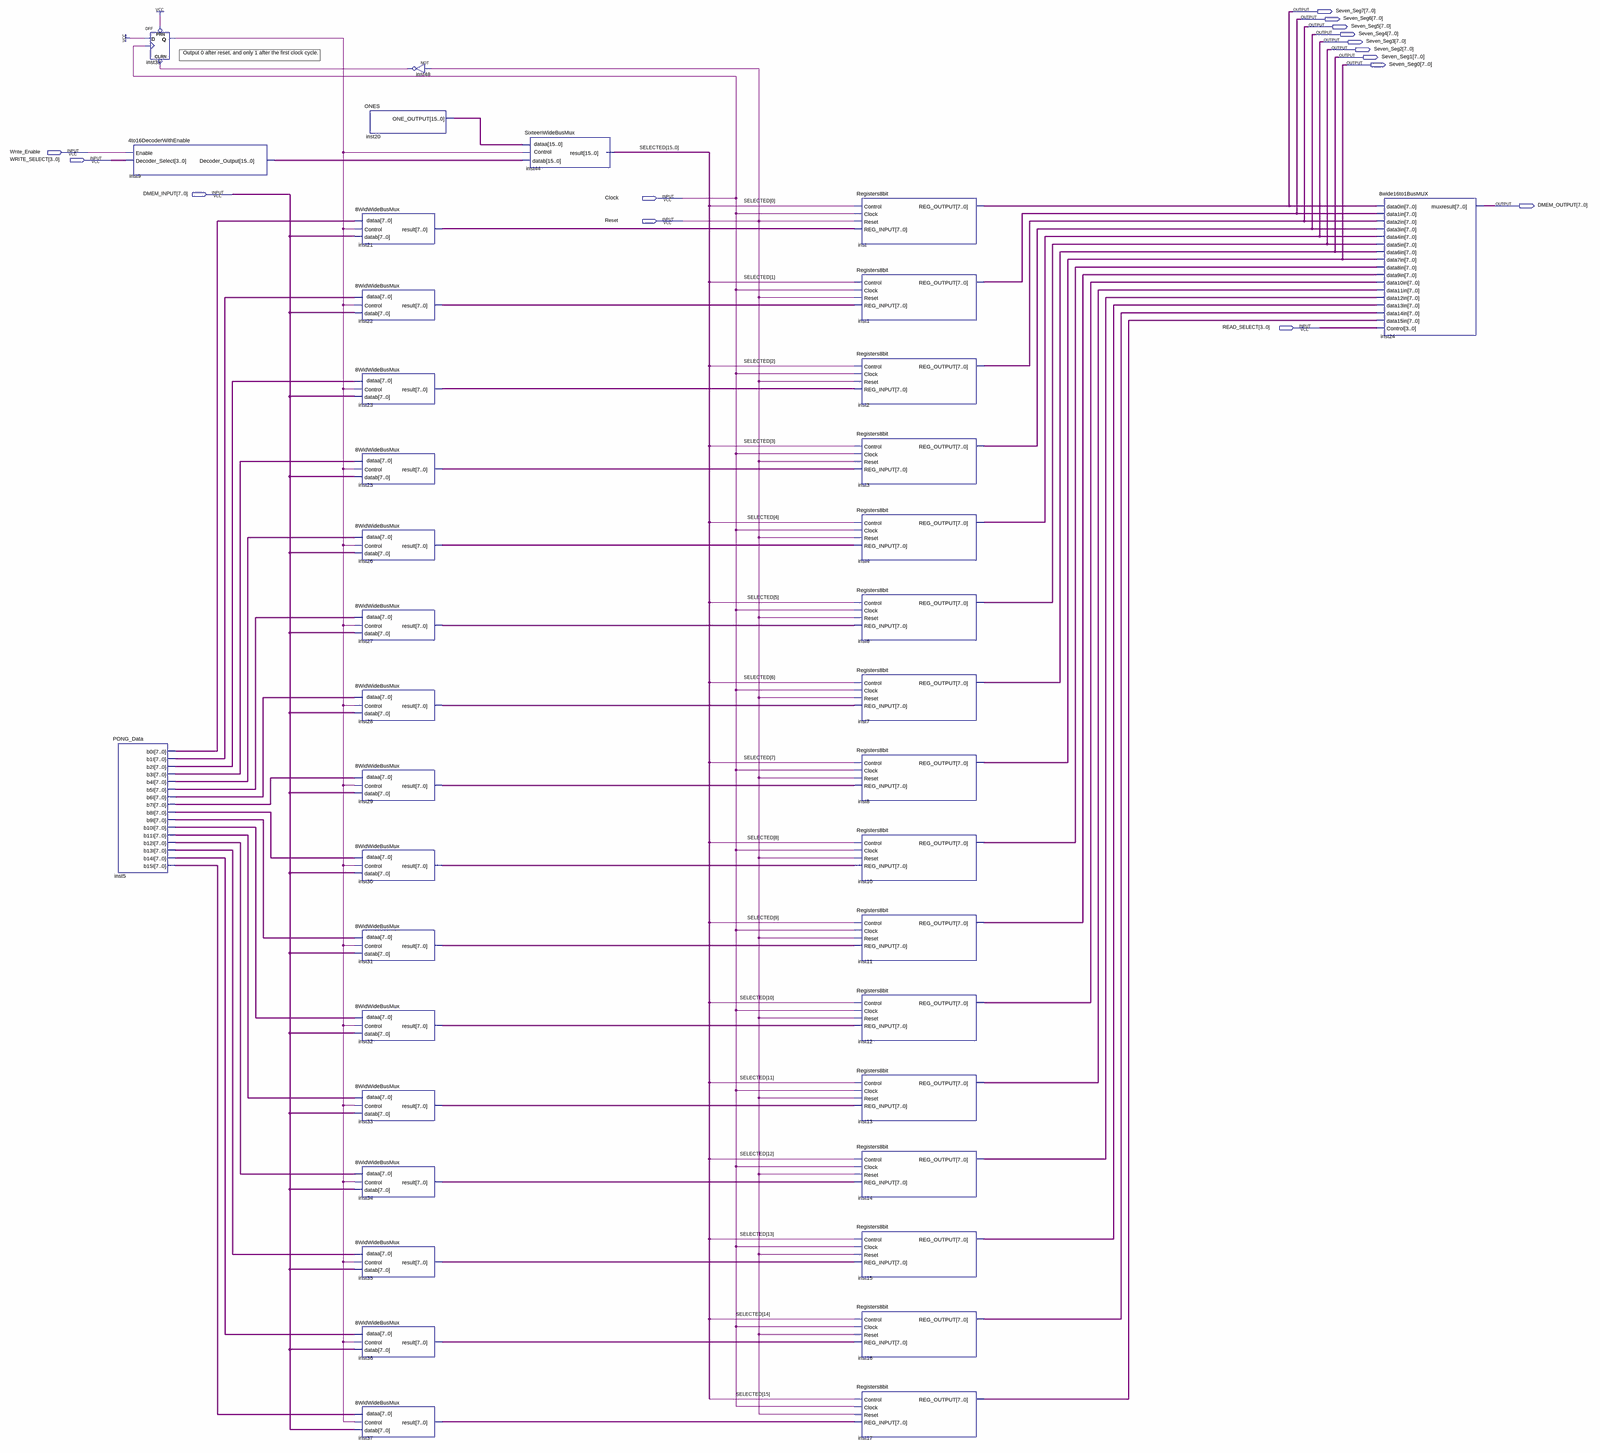
[diagram p0: schematic sheet, whole]
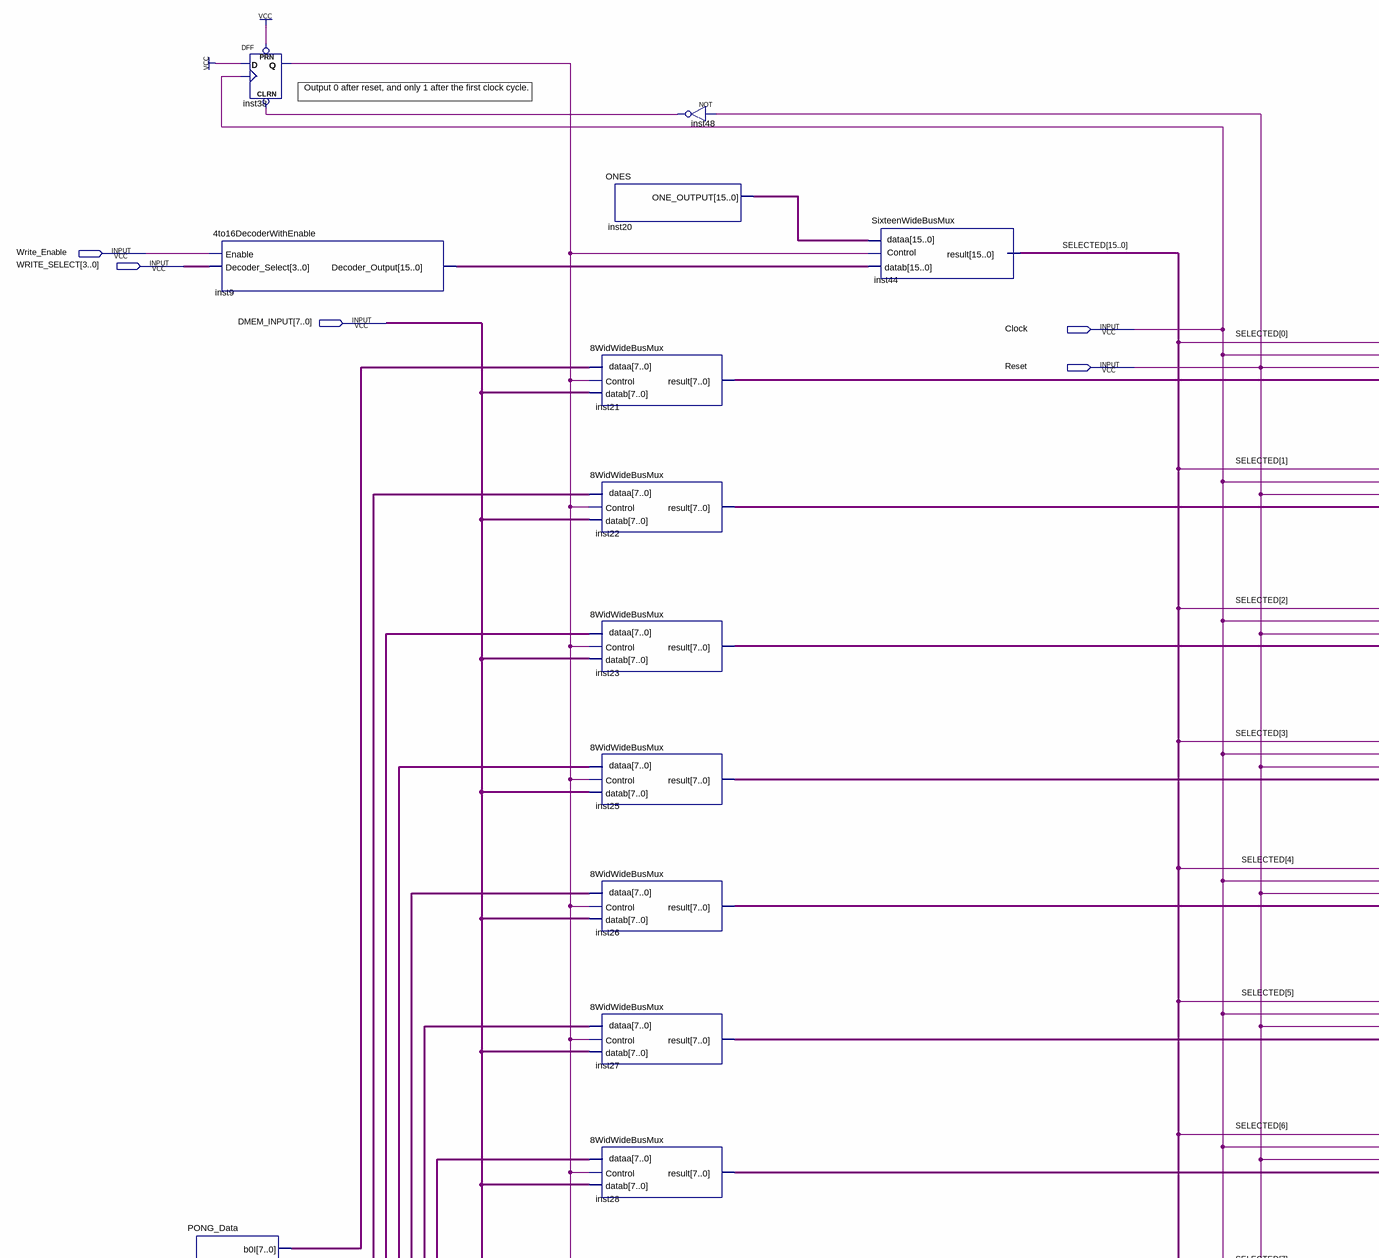
[diagram p1: schematic sheet, upper left part]
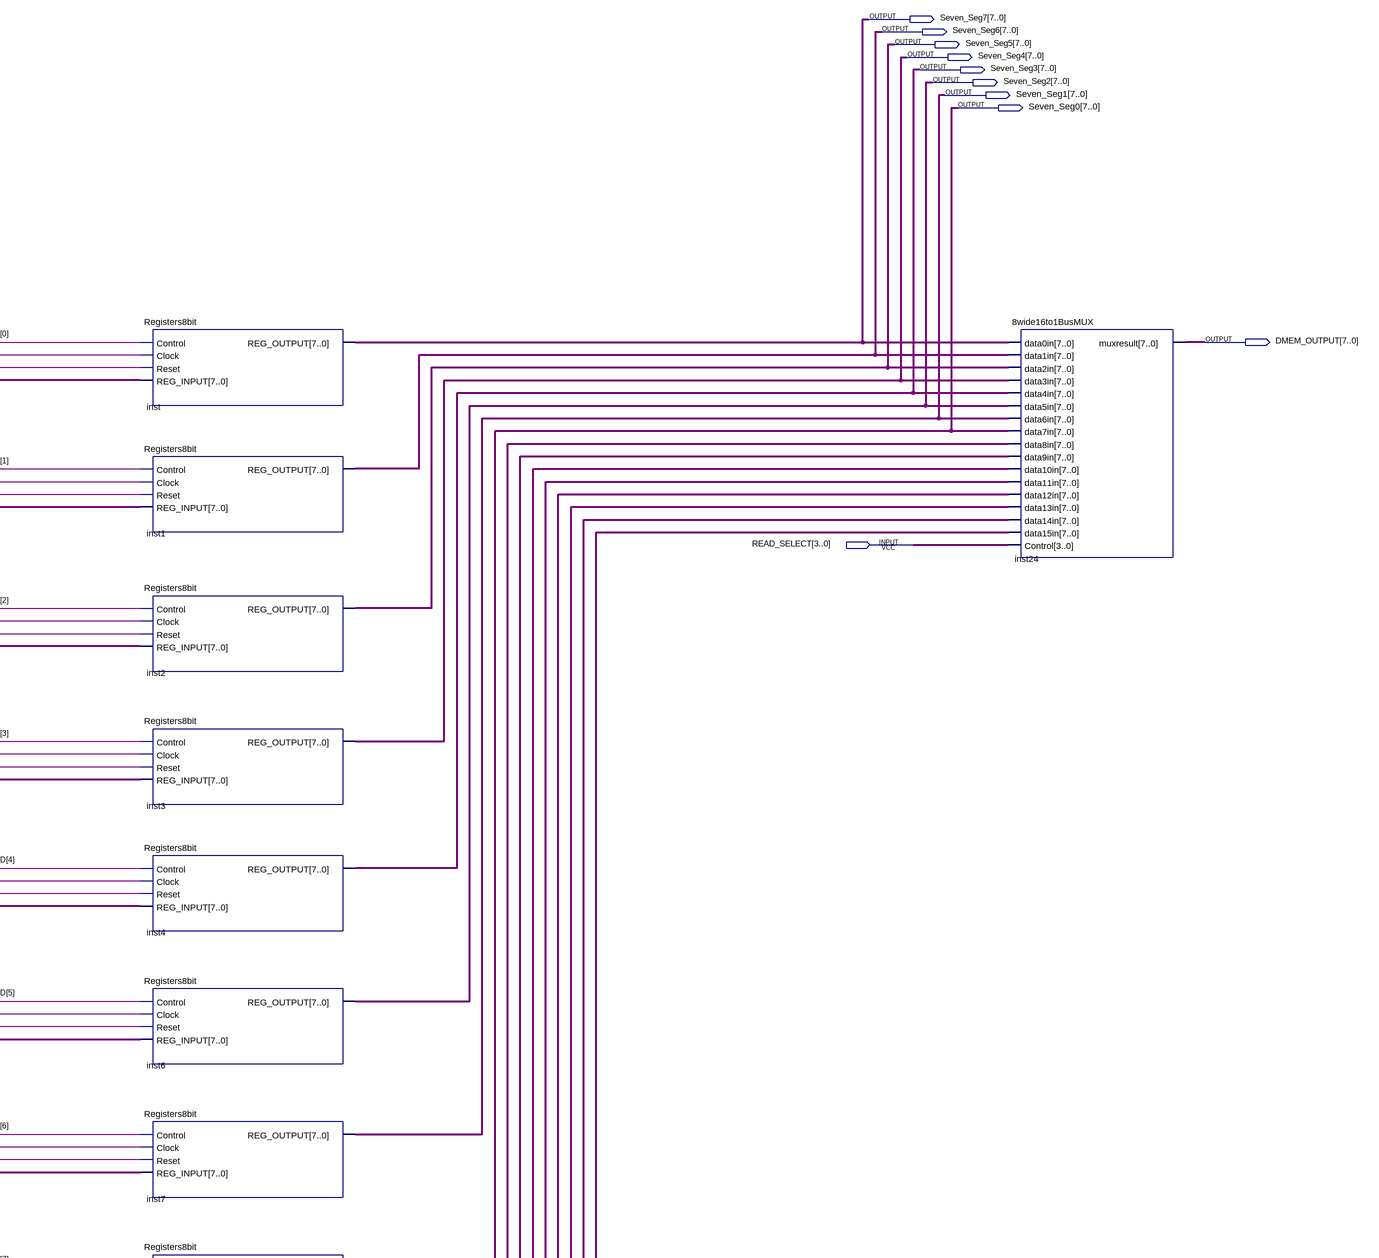
[diagram p2: schematic sheet, upper right part]
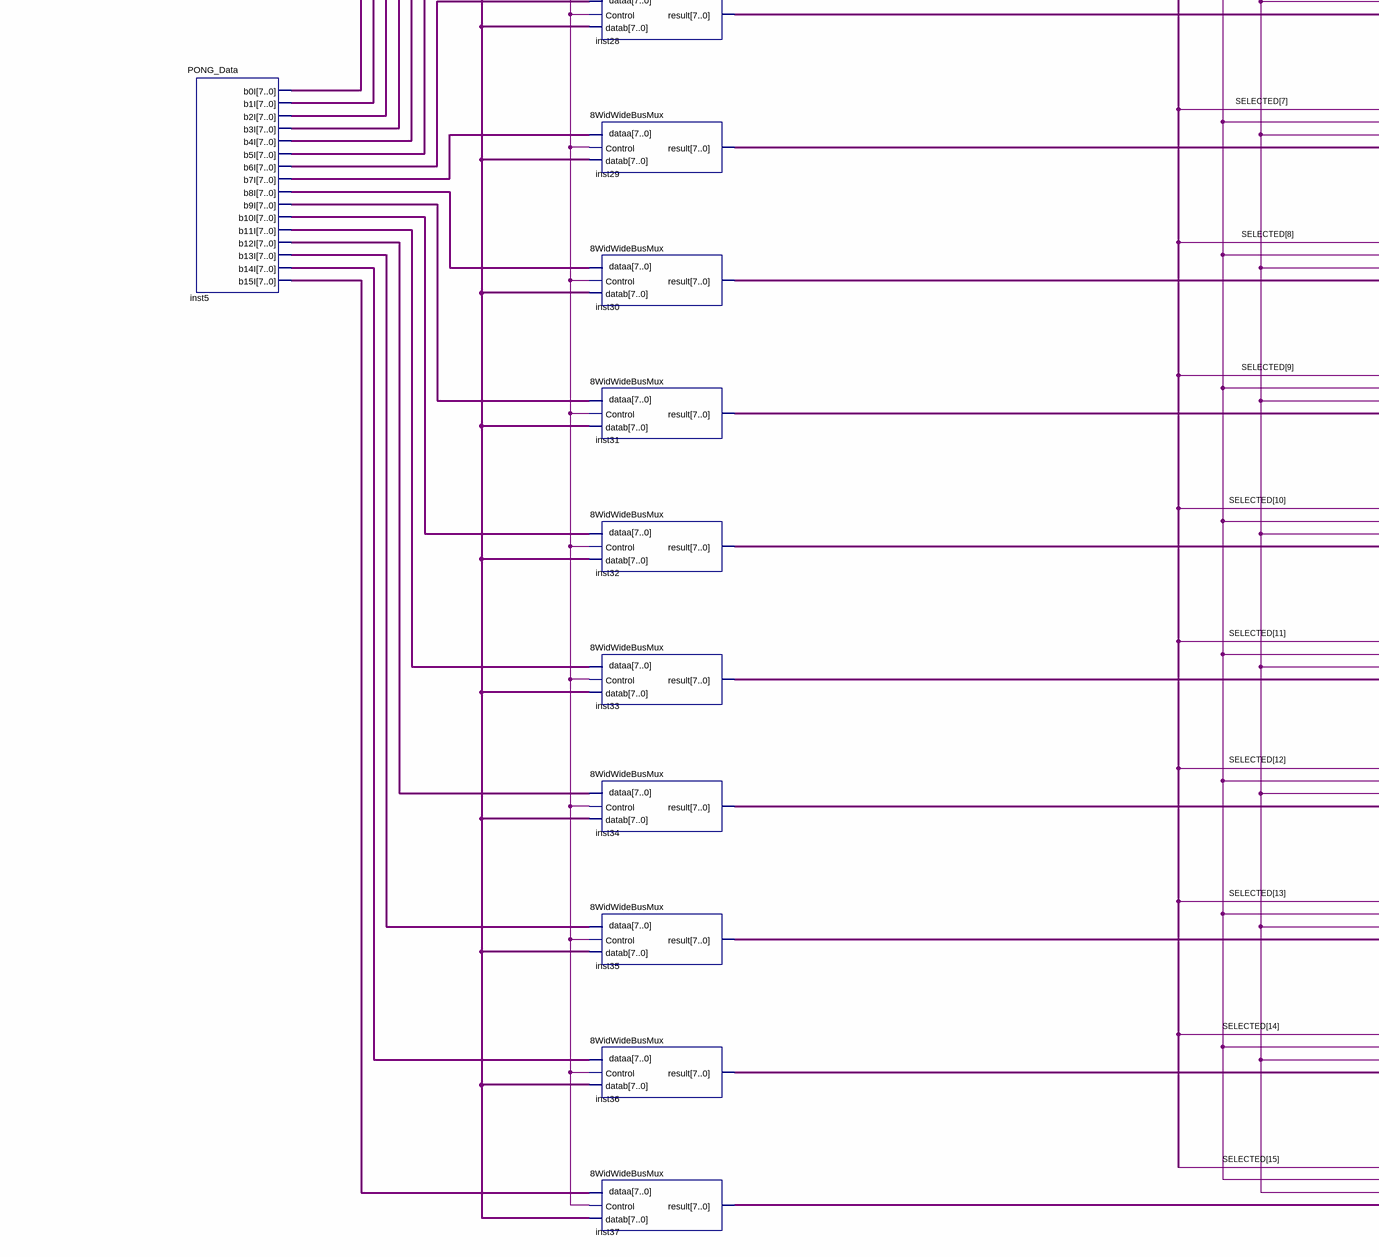
[diagram p3: schematic sheet, lower left part]
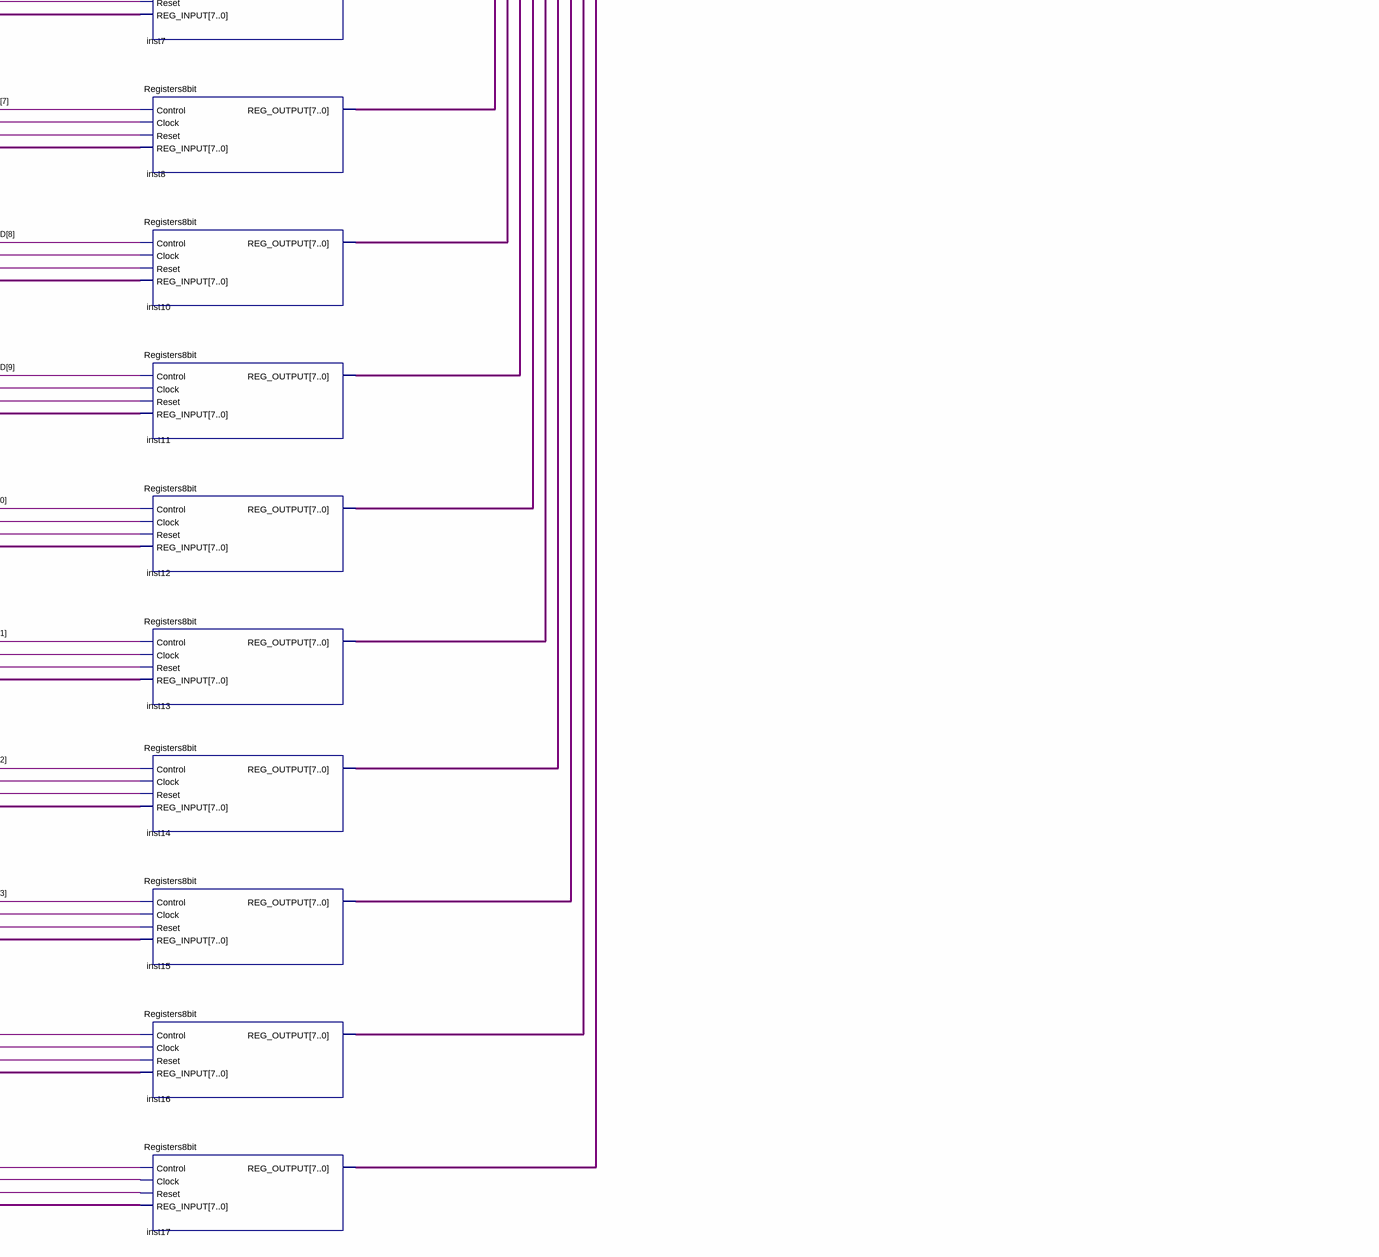
[diagram p4: schematic sheet, lower right part]
// Quartus schematic DMEM.bdf as structural Verilog: 39 symbols, 15 pins
module DMEM (
  input  Write_Enable,
  input  [3:0] WRITE_SELECT,
  input  [7:0] DMEM_INPUT,
  input  Clock,
  input  Reset,
  input  [3:0] READ_SELECT,
  output [7:0] Seven_Seg7,
  output [7:0] Seven_Seg6,
  output [7:0] Seven_Seg5,
  output [7:0] Seven_Seg4,
  output [7:0] Seven_Seg3,
  output [7:0] Seven_Seg2,
  output [7:0] Seven_Seg1,
  output [7:0] Seven_Seg0,
  output [7:0] DMEM_OUTPUT
);

  wire inst38_q, inst48_out;
  wire [7:0] inst5_b0i, inst5_b1i, inst5_b2i, inst5_b3i, inst5_b4i, inst5_b5i, inst5_b6i, inst5_b7i,
       inst5_b8i, inst5_b9i, inst5_b10i, inst5_b11i, inst5_b12i, inst5_b13i, inst5_b14i, inst5_b15i,
       inst10_reg_output, inst11_reg_output, inst12_reg_output, inst13_reg_output, inst14_reg_output,
       inst15_reg_output, inst16_reg_output, inst17_reg_output, inst21_result, inst22_result, inst23_result,
       inst25_result, inst26_result, inst27_result, inst28_result, inst29_result, inst30_result,
       inst31_result, inst32_result, inst33_result, inst34_result, inst35_result, inst36_result,
       inst37_result;
  wire [15:0] inst9_decoder_output, inst20_one_output, SELECTED;

  \4to16DecoderWithEnable  inst9 (
    .Enable(Write_Enable), .Decoder_Select(WRITE_SELECT), .Decoder_Output(inst9_decoder_output));
  PONG_Data inst5 (
    .b0I(inst5_b0i), .b1I(inst5_b1i), .b2I(inst5_b2i), .b3I(inst5_b3i), .b4I(inst5_b4i), .b5I(inst5_b5i),
    .b6I(inst5_b6i), .b7I(inst5_b7i), .b8I(inst5_b8i), .b9I(inst5_b9i), .b10I(inst5_b10i), .b11I(inst5_b11i),
    .b12I(inst5_b12i), .b13I(inst5_b13i), .b14I(inst5_b14i), .b15I(inst5_b15i));
  DFF inst38 (.CLRN(inst48_out), .CLK(Clock), .D(1'b1), .PRN(1'b1), .Q(inst38_q));
  ONES inst20 (.ONE_OUTPUT(inst20_one_output));
  \8WidWideBusMux  inst21 (.Control(inst38_q), .dataa(inst5_b0i), .datab(DMEM_INPUT), .result(inst21_result));
  \8WidWideBusMux  inst22 (.Control(inst38_q), .dataa(inst5_b1i), .datab(DMEM_INPUT), .result(inst22_result));
  \8WidWideBusMux  inst23 (.Control(inst38_q), .dataa(inst5_b2i), .datab(DMEM_INPUT), .result(inst23_result));
  \8WidWideBusMux  inst25 (.Control(inst38_q), .dataa(inst5_b3i), .datab(DMEM_INPUT), .result(inst25_result));
  \8WidWideBusMux  inst26 (.Control(inst38_q), .dataa(inst5_b4i), .datab(DMEM_INPUT), .result(inst26_result));
  \8WidWideBusMux  inst27 (.Control(inst38_q), .dataa(inst5_b5i), .datab(DMEM_INPUT), .result(inst27_result));
  \8WidWideBusMux  inst28 (.Control(inst38_q), .dataa(inst5_b6i), .datab(DMEM_INPUT), .result(inst28_result));
  \8WidWideBusMux  inst29 (.Control(inst38_q), .dataa(inst5_b7i), .datab(DMEM_INPUT), .result(inst29_result));
  \8WidWideBusMux  inst30 (.Control(inst38_q), .dataa(inst5_b8i), .datab(DMEM_INPUT), .result(inst30_result));
  \8WidWideBusMux  inst31 (.Control(inst38_q), .dataa(inst5_b9i), .datab(DMEM_INPUT), .result(inst31_result));
  \8WidWideBusMux  inst32 (.Control(inst38_q), .dataa(inst5_b10i), .datab(DMEM_INPUT), .result(inst32_result));
  \8WidWideBusMux  inst33 (.Control(inst38_q), .dataa(inst5_b11i), .datab(DMEM_INPUT), .result(inst33_result));
  \8WidWideBusMux  inst34 (.Control(inst38_q), .dataa(inst5_b12i), .datab(DMEM_INPUT), .result(inst34_result));
  \8WidWideBusMux  inst35 (.Control(inst38_q), .dataa(inst5_b13i), .datab(DMEM_INPUT), .result(inst35_result));
  \8WidWideBusMux  inst36 (.Control(inst38_q), .dataa(inst5_b14i), .datab(DMEM_INPUT), .result(inst36_result));
  \8WidWideBusMux  inst37 (.Control(inst38_q), .dataa(inst5_b15i), .datab(DMEM_INPUT), .result(inst37_result));
  not inst48 (inst48_out, Reset);
  SixteenWideBusMux inst44 (
    .Control(inst38_q), .dataa(inst20_one_output), .datab(inst9_decoder_output), .result(SELECTED));
  Registers8bit inst (
    .Control(SELECTED[0]), .Clock(Clock), .Reset(Reset), .REG_INPUT(inst21_result), .REG_OUTPUT(Seven_Seg7));
  Registers8bit inst1 (
    .Control(SELECTED[1]), .Clock(Clock), .Reset(Reset), .REG_INPUT(inst22_result), .REG_OUTPUT(Seven_Seg6));
  Registers8bit inst2 (
    .Control(SELECTED[2]), .Clock(Clock), .Reset(Reset), .REG_INPUT(inst23_result), .REG_OUTPUT(Seven_Seg5));
  Registers8bit inst3 (
    .Control(SELECTED[3]), .Clock(Clock), .Reset(Reset), .REG_INPUT(inst25_result), .REG_OUTPUT(Seven_Seg4));
  Registers8bit inst4 (
    .Control(SELECTED[4]), .Clock(Clock), .Reset(Reset), .REG_INPUT(inst26_result), .REG_OUTPUT(Seven_Seg3));
  Registers8bit inst6 (
    .Control(SELECTED[5]), .Clock(Clock), .Reset(Reset), .REG_INPUT(inst27_result), .REG_OUTPUT(Seven_Seg2));
  Registers8bit inst7 (
    .Control(SELECTED[6]), .Clock(Clock), .Reset(Reset), .REG_INPUT(inst28_result), .REG_OUTPUT(Seven_Seg1));
  Registers8bit inst8 (
    .Control(SELECTED[7]), .Clock(Clock), .Reset(Reset), .REG_INPUT(inst29_result), .REG_OUTPUT(Seven_Seg0));
  Registers8bit inst10 (
    .Control(SELECTED[8]), .Clock(Clock), .Reset(Reset), .REG_INPUT(inst30_result),
    .REG_OUTPUT(inst10_reg_output));
  Registers8bit inst11 (
    .Control(SELECTED[9]), .Clock(Clock), .Reset(Reset), .REG_INPUT(inst31_result),
    .REG_OUTPUT(inst11_reg_output));
  Registers8bit inst12 (
    .Control(SELECTED[10]), .Clock(Clock), .Reset(Reset), .REG_INPUT(inst32_result),
    .REG_OUTPUT(inst12_reg_output));
  Registers8bit inst13 (
    .Control(SELECTED[11]), .Clock(Clock), .Reset(Reset), .REG_INPUT(inst33_result),
    .REG_OUTPUT(inst13_reg_output));
  Registers8bit inst14 (
    .Control(SELECTED[12]), .Clock(Clock), .Reset(Reset), .REG_INPUT(inst34_result),
    .REG_OUTPUT(inst14_reg_output));
  Registers8bit inst15 (
    .Control(SELECTED[13]), .Clock(Clock), .Reset(Reset), .REG_INPUT(inst35_result),
    .REG_OUTPUT(inst15_reg_output));
  Registers8bit inst16 (
    .Control(SELECTED[14]), .Clock(Clock), .Reset(Reset), .REG_INPUT(inst36_result),
    .REG_OUTPUT(inst16_reg_output));
  Registers8bit inst17 (
    .Control(SELECTED[15]), .Clock(Clock), .Reset(Reset), .REG_INPUT(inst37_result),
    .REG_OUTPUT(inst17_reg_output));
  \8wide16to1BusMUX  inst24 (
    .data0in(Seven_Seg7), .data1in(Seven_Seg6), .data2in(Seven_Seg5), .data3in(Seven_Seg4),
    .data4in(Seven_Seg3), .data5in(Seven_Seg2), .data6in(Seven_Seg1), .data7in(Seven_Seg0),
    .data8in(inst10_reg_output), .data9in(inst11_reg_output), .data10in(inst12_reg_output),
    .data11in(inst13_reg_output), .data12in(inst14_reg_output), .data13in(inst15_reg_output),
    .data14in(inst16_reg_output), .data15in(inst17_reg_output), .Control(READ_SELECT), .muxresult(DMEM_OUTPUT));

  // Notes on the sheet:
  //   Output 0 after reset, and only 1 after the first clock cycle.
endmodule
